# Altium schematic sheet Gyro Sensor.SchDoc
size A; SheetNumber: 4; SheetTotal: 4
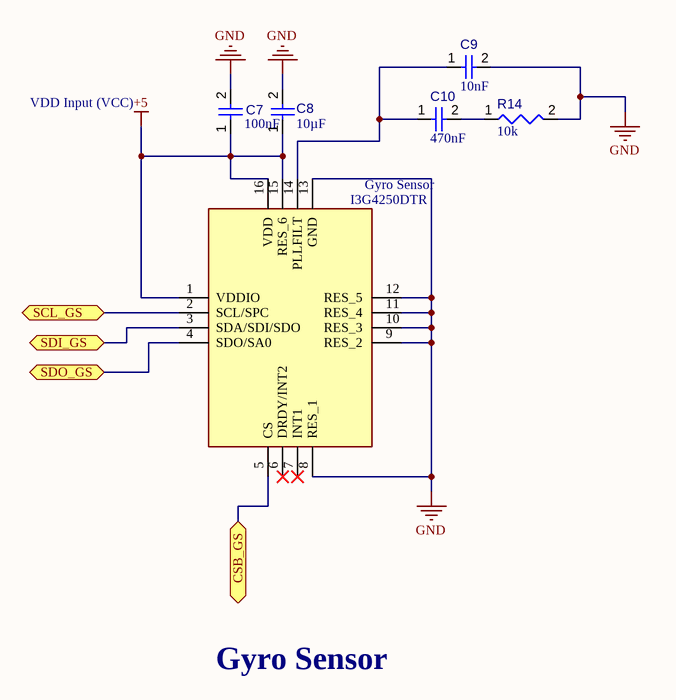
[diagram p0: Gyro Sensor.SchDoc]

## Parts
C7  value 100nF  [CAPC0402(1005)60_L]  (hidden comment: Capacitor 100nF +/-20% 10V 0402)
C8  value 10µF  [CAPC0402(1005)60_L]  (hidden comment: Capacitor 10µF +/-40% 6.3V 0402)
C9  value 10nF  [CAPC0402(1005)60_L]  (hidden comment: Capacitor 10nF +/-20% 50V 0402)
C10  value 470nF  [CAPC0603(1608)100_L]  (hidden comment: Capacitor 470nF +/-20% 25V 0603)
Gyro_Sensor  I3G4250DTR  [LGA-16L(4X4X1.1MM)]
R14  value 10k  [RESC3216X60X45ML15T20]  (hidden comment: Resistor 10k +/-1% 1206 250 mW)

## Ports
CSB_GS (bidir, see Sunsat Full Schematic[3B]), SCL_GS (bidir, see Sunsat Full Schematic[1B]), SDI_GS (bidir, see Sunsat Full Schematic[3C]), SDO_GS (bidir, see Sunsat Full Schematic[1B])

## Nets
+5: C7.1 C8.1 Gyro_Sensor.1(VDDIO) Gyro_Sensor.15(RES_6) Gyro_Sensor.16(VDD)
GND: C7.2 C8.2 C9.2 Gyro_Sensor.8(RES_1) Gyro_Sensor.9(RES_2) Gyro_Sensor.10(RES_3) Gyro_Sensor.11(RES_4) Gyro_Sensor.12(RES_5) Gyro_Sensor.13(GND) R14.2
CSB_GS: Gyro_Sensor.5(CS) ; port CSB_GS
SCL_GS: Gyro_Sensor.2(SCL/SPC) ; port SCL_GS
SDI_GS: Gyro_Sensor.3(SDA/SDI/SDO) ; port SDI_GS
SDO_GS: Gyro_Sensor.4(SDO/SA0) ; port SDO_GS
NetC9_1: C9.1 C10.1 Gyro_Sensor.14(PLLFILT)
NetC10_2: C10.2 R14.1

Not connected (* = marked no-connect by the designer): Gyro_Sensor 6(DRDY/INT2)* 7(INT1)*

## Notes on the sheet
- VDD Input (VCC)
- Gyro Sensor

## Library data of the parts
C7 = CMP-001-00061-3: Chip Capacitor, 100nF +/-20%, 10V, 0402, Thickness 0.6 mm; Tolerance: 20%; Mounting Technology: SMT; Voltage Rating: 10V; Max Operating Temperature: 85°C; Pins: 2; Case/Package: 0402; Min Operating Temperature: -55°C
C8 = CMP-001-00074-3: Chip Capacitor, 10µF +/-40%, 6.3V, 0402, Thickness 0.6 mm; Tolerance: 10%; Case/Package: 0402; Pins: 2; Mounting Technology: SMT; Voltage Rating: 6.3V; Max Operating Temperature: 85°C; Min Operating Temperature: -55°C
C9 = CMP-001-00069-3: Chip Capacitor, 10nF +/-20%, 50V, 0402, Thickness 0.6 mm; Tolerance: 5%; Max Operating Temperature: 85°C; Pins: 2; Case/Package: 0402; Voltage Rating: 50V; Min Operating Temperature: -55°C; Mounting Technology: SMT
C10 = CMP-001-00077-3: Chip Capacitor, 470nF +/-20%, 25V, 0603, Thickness 1 mm; Tolerance: 10%; Max Operating Temperature: 85°C; Voltage Rating: 25V; Pins: 2; Case/Package: 0603; Mounting Technology: SMT; Min Operating Temperature: -55°C
Gyro_Sensor = I3G4250DTR: Integrated Circuit; Manufacturer_Name: STMicroelectronics; Datasheet Link: http://www.st.com/content/ccc/resource/technical/document/datasheet/e4/b1/d1/62/1a/e6/44/2f/DM00168691.pdf/files/DM00168691.pdf/jcr:content/translations/en.DM00168691.pdf; Manufacturer_Part_Number: I3G4250DTR; Mouser Part Number: 511-I3G4250DTR; Mouser Price/Stock: https://www.mouser.co.uk/ProductDetail/STMicroelectronics/I3G4250DTR?qs=v3MacVxtdDJPIS9io4RmPA%3D%3D; Arrow Part Number: I3G4250DTR; Arrow Price/Stock: https://www.arrow.com/en/products/i3g4250dtr/stmicroelectronics
R14 = CMP-009-00016-5: Chip Resistor, 10 KOhm, +/- 1%, 0.25 W, -55 to 155 degC, 1206 (3216 Metric); Power: 250mW; Voltage Rating: 200V; Pins: 2; Max Operating Temperature: 155°C; Tolerance: 1%; RoHS Compliant: True; Case/Package: 1206; Min Operating Temperature: -55°C; Mounting Technology: SM